# EasyEDA Pro project RM_超级电容控制板.eprj, board PCB_超电功率板
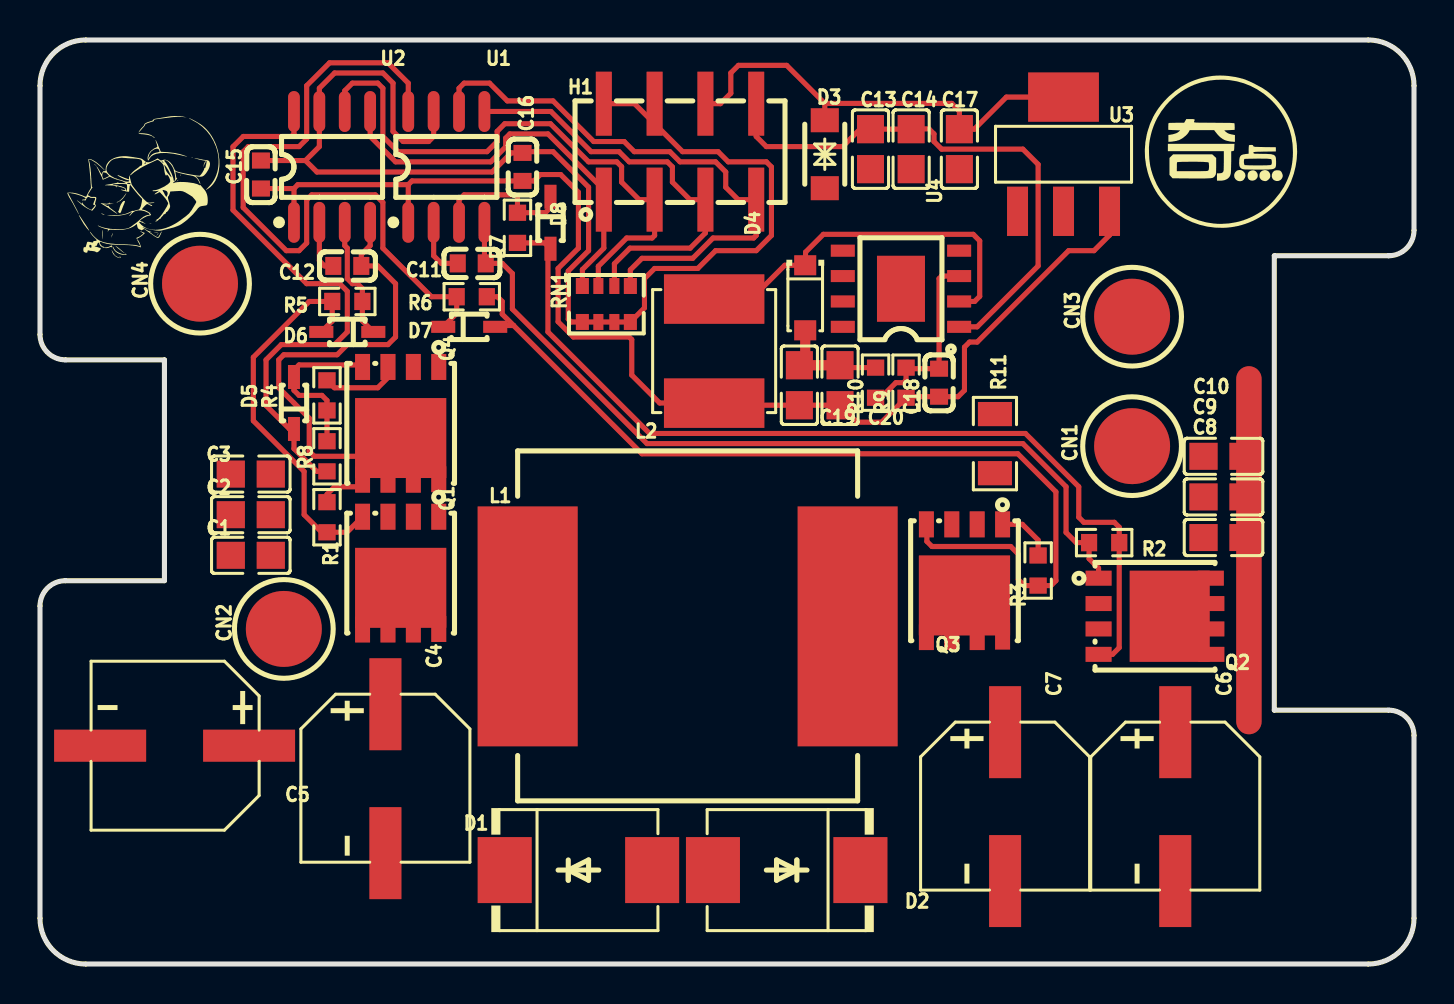
[diagram p5: board, top side]
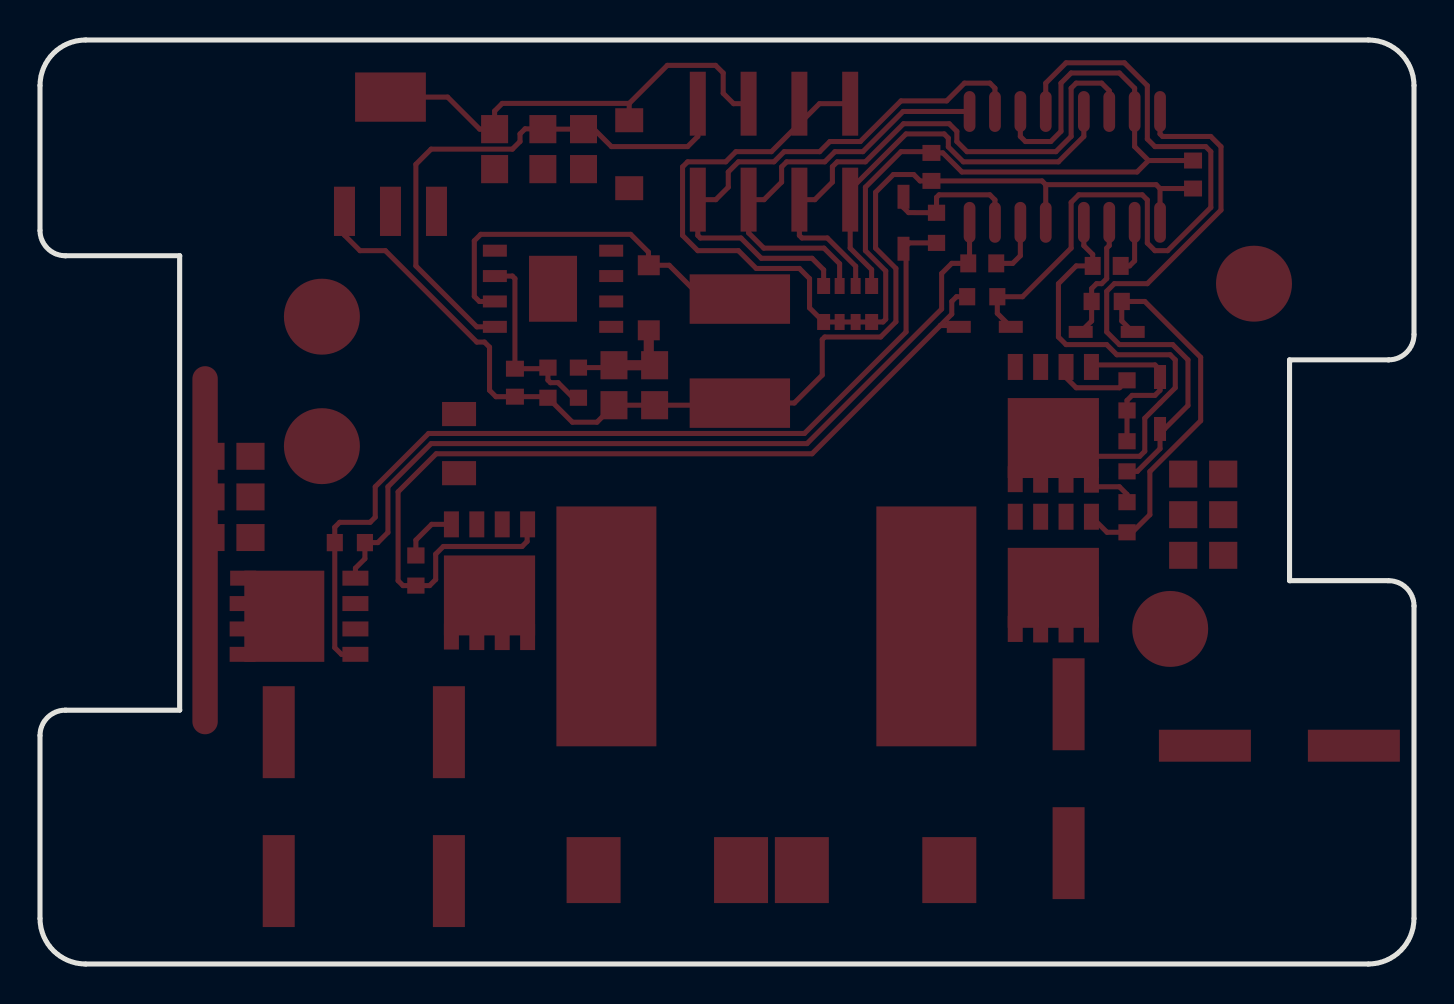
[diagram p6: board, bottom side, seen from below]

Outline 68.71 x 46.23 mm; copper layers: Top Layer, Bottom Layer. Coordinates in mm from the lower left corner of the outline.
Outline path: 0,43.94 arc(0.67,45.56) 2.29,46.23 66.42,46.23 arc(68.04,45.56) 68.71,43.94 68.71,36.7 arc(68.34,35.8) 67.44,35.43 61.72,35.43 61.72,12.7 67.44,12.7 arc(68.34,12.33) 68.71,11.43 68.71,2.29 arc(68.04,0.67) 66.42,0 2.29,0 arc(0.67,0.67) 0,2.29 0,17.91 arc(0.37,18.81) 1.27,19.18 6.22,19.18 6.22,30.23 1.27,30.23 arc(0.37,30.6) 0,31.5 0,43.94
Stack: Top Layer 0.035mm / Dielectric1 1.51mm FR4 er 4.5 / Bottom Layer 0.035mm

## Design rules (mm)
spacing Default (default): track to track 0.152, other pairs 0 to 0.152
track width Default (default): min 0.254, default 0.254, max 25.4
differential pair differentialPair (default): width min 0.127, default 0.254, max 2.54; gap min 0.152, default 0.152
via Default (default): diameter min 0.61, default 0.61, max 100.025; hole min 0.305, default 0.305, max 59.995
net SW1 uses gge220560
net VCC uses gge220506
net SW2 uses gge220569
net VCUP uses gge220584
net GND uses gge220668
pour e2 uses gge178568(1)
pour e379 uses gge220506
pour e380 uses gge220560
pour e381 uses gge220569
pour e382 uses gge220584
pour e383 uses gge220668

## Placement (name value [footprint] x y rotation side)
C1  22uF  [C0805]  10.54 20.45 180 top
C2  22uF  [C0805]  10.54 22.48 180 top
C3  22uF  [C0805]  10.54 24.51 180 top
C4  220uF  [CAP-SMD_BD8.0-L8.3-W8.3-LS9.3-FD]  17.27 9.27 270 top
C5  220uF  [CAP-SMD_BD8.0-L8.3-W8.3-LS9.3-FD]  6.73 10.92 180 top
C6  220uF  [CAP-SMD_BD8.0-L8.3-W8.3-LS9.3-FD]  56.77 7.87 270 top
C7  220uF  [CAP-SMD_BD8.0-L8.3-W8.3-LS9.3-FD]  48.26 7.87 270 top
C8  22uF  [C0805]  59.18 21.34 0 top
C9  22uF  [C0805]  59.18 23.37 0 top
C10  22uF  [C0805]  59.18 25.4 0 top
C11  100n  [C0603]  21.59 35.05 180 top
C12  100nF  [C0603]  15.37 34.92 180 top
C13  22uF  [C0805]  41.53 40.77 270 top
C14  22uF  [C0805]  43.56 40.77 270 top
C15  1uF  [C0603]  11.05 39.5 90 top
C16  1uF  [C0603]  24.13 39.88 90 top
C17  22uF  [C0805]  45.97 40.77 270 top
C18  330pF  [C0603]  44.96 29.08 90 top
C19  22uF  [C0805]  37.97 28.96 90 top
C20  22uF  [C0805]  40 28.96 90 top
CN1  m3铜柱  [SMT铜柱]  54.61 25.91 0 top
CN2  m3铜柱  [SMT铜柱]  12.19 16.76 0 top
CN3  m3铜柱  [SMT铜柱]  54.61 32.39 0 top
CN4  m3铜柱  [SMT铜柱]  8 34.04 0 top
D1  5.0SMDJ30A  [SMC_L6.9-W5.9-LS7.9-RD]  26.92 4.7 0 top
D2  5.0SMDJ30A  [SMC_L6.9-W5.9-LS7.9-RD]  37.34 4.7 180 top
D3  SMFJ5.0CA  [SOD-123FL_L2.8-W1.8-LS3.7-BI]  39.24 40.51 90 top
D4  DSK310_C713648  [SOD-123_L2.7-W1.8-LS3.7-RD]  38.26 33.33 270 top
D5  1N4007WS  [SOD-323_L1.6-W1.3-LS2.6-RD]  12.7 28.07 90 top
D6  1N4007WS  [SOD-323_L1.6-W1.3-LS2.6-RD]  15.37 31.62 180 top
D7  1N4007WS  [SOD-323_L1.6-W1.3-LS2.6-RD]  21.46 31.88 0 top
D8  1N4007WS  [SOD-323_L1.6-W1.3-LS2.6-RD]  25.53 37.08 270 top
H1  MF254VS-12-08P  [HDR-SMD_8P-P2.54_MF254VS-12-08P]  32 40.64 0 top
L1  15uH  [IND-SMD_L17.5-W17.0_YXMAC1770]  32.38 16.89 0 top
L2  330uH  [IND-SMD_L6.0-W6.0_SWPA6045S]  33.71 30.66 90 top
Q1  BSC070N10NS5  [PG-TDSON-8_L5.0-W6.0-P1.27-BL-EP]  18.03 19.56 180 top
Q2  BSC070N10NS5  [PG-TDSON-8_L5.0-W6.0-P1.27-BL-EP]  55.75 17.4 270 top
Q3  BSC070N10NS5  [PG-TDSON-8_L5.0-W6.0-P1.27-BL-EP]  46.23 19.18 180 top
Q4  BSC070N10NS5  [PG-TDSON-8_L5.0-W6.0-P1.27-BL-EP]  18.03 27.05 180 top
R1  10k  [R0603]  14.35 22.35 90 top
R2  10k  [R0603]  53.21 21.08 180 top
R3  10k  [R0603]  49.91 19.69 90 top
R4  10k  [R0603]  14.35 28.45 270 top
R5  4.7  [R0603]  15.37 33.15 180 top
R6  4.7  [R0603]  21.59 33.38 0 top
R7  4.7  [R0603]  23.88 36.83 270 top
R8  4.7  [R0603]  14.35 25.4 90 top
R9  33k  [R0603]  43.31 29.08 90 top
R10  4.7k  [R0603]  41.78 29.08 90 top
R11  0  [R1206]  47.75 26.03 90 top
RN1  10k  [RES-ARRAY-SMD_0603-8P-L3.2-W1.6-BL]  28.32 33.02 180 top
U1  UCC27211D  [SOIC-8_L4.9-W3.9-P1.27-LS6.2-BL]  20.32 39.88 0 top
U2  UCC27211D  [SOIC-8_L4.9-W3.9-P1.27-LS6.2-BL]  14.6 39.88 0 top
U3  AMS1117-5.0  [SOT-223_L6.5-W3.5-P2.30-LS7.0-BR]  51.18 40.51 270 top
U4  XL7005ADJ  [ESOP-8_L4.9-W3.9-P1.27-LS6.0-BL-EP]  43.05 33.78 90 top

## Footprints (pads in the part's own frame, mm; a bottom-side part is the same pattern mirrored in y, then rotated)
C0603
  rect 0.8x0.9 smd: 1(-0.7,0) 2(0.7,0)
C0805
  rect 1.41x1.35 smd: 1(-1,0) 2(1,0)
CAP-SMD_BD8.0-L8.3-W8.3-LS9.3-FD
  rect 4.6x1.6 smd: 1(-3.724,0) 2(3.724,0)
ESOP-8_L4.9-W3.9-P1.27-LS6.0-BL-EP
  rect 0.6x1.2 smd: 1(-1.905,-2.909) 2(-0.635,-2.909) 3(0.635,-2.909) 4(1.905,-2.909) 5(1.905,2.909) 6(0.635,2.909) 7(-0.635,2.909) 8(-1.905,2.909)
  rect 3.3x2.4 smd: 9(0,0)
HDR-SMD_8P-P2.54_MF254VS-12-08P
  rect 0.8x3.2 smd: 1(-3.81,-2.4) 2(-3.81,2.4) 3(-1.27,-2.4) 4(-1.27,2.4) 5(1.27,-2.4) 6(1.27,2.4) 7(3.81,-2.4) 8(3.81,2.4)
IND-SMD_L6.0-W6.0_SWPA6045S
  rect 2.474x5.02 smd: 1(-2.603,0) 2(2.603,0)
IND-SMD_L17.5-W17.0_YXMAC1770
  rect 5x12 smd: 1(-8,0) 2(8,0)
PG-TDSON-8_L5.0-W6.0-P1.27-BL-EP
  rect 0.75x1.3 smd: 1(-1.905,-2.82) 2(-0.635,-2.82) 3(0.635,-2.82) 4(1.905,-2.82) 5(1.905,2.82) 6(0.635,2.82) 7(-0.635,2.82) 8(-1.905,2.794)
  rect 4.56x4 smd: 9(0,0.737)
R0603
  rect 0.806x0.864 smd: 1(-0.753,0) 2(0.753,0)
R1206
  rect 1.208x1.701 smd: 1(-1.479,0) 2(1.479,0)
RES-ARRAY-SMD_0603-8P-L3.2-W1.6-BL
  rect 0.65x0.8 smd: 1(-1.2,-0.9) 4(1.2,-0.9) 5(1.2,0.9) 8(-1.2,0.9)
  rect 0.5x0.8 smd: 2(-0.4,-0.9) 3(0.4,-0.9) 6(0.4,0.9) 7(-0.4,0.9)
SMC_L6.9-W5.9-LS7.9-RD
  rect 2.7x3.3 smd: 1(-3.687,0) 2(3.687,0)
SMT铜柱
  round 3.8 smd: 1(0.001,0)
SOD-123_L2.7-W1.8-LS3.7-RD
  rect 1x1.1 smd: 1(-1.627,0) 2(1.627,0)
SOD-123FL_L2.8-W1.8-LS3.7-BI
  rect 1.2x1.4 smd: 1(-1.7,0) 2(1.7,0)
SOD-323_L1.6-W1.3-LS2.6-RD
  rect 1.2x0.6 smd: 1(-1.3,0) 2(1.3,0)
SOIC-8_L4.9-W3.9-P1.27-LS6.2-BL
  oval 0.588x2.045 smd: 1(-1.905,-2.772) 2(-0.635,-2.772) 3(0.635,-2.772) 4(1.905,-2.772) 5(1.905,2.772) 6(0.635,2.772) 7(-0.635,2.772) 8(-1.905,2.772)
SOT-223_L6.5-W3.5-P2.30-LS7.0-BR
  rect 2.465x1.05 smd: 1(2.857,-2.3) 2(2.857,0) 3(2.857,2.3)
  rect 2.465x3.54 smd: 4(-2.857,0)

## Nets
As in the schematic.

Pads without a net: Q1 9; Q2 9; Q3 9; Q4 9; U3 2; U4 4

## Routing (per net, layer and track width the routed paths; a pad name or vN(x,y) marks a point on that pad's centre or on a via; arc(x,y) is an arc through that point)
10V: length 64.5
  Top Layer w0.254: 53.1,37.48 53.28,37.66 53.48,37.66 53.48,36.46 52.71,35.69 51.44,35.69 46.86,31.11 46.48,31.11 46.23,30.86 46.23,28.7 45.91,28.38 44.96,28.38 ; U2.1 12.7,38.8 ; 12.7,38.8 C15.1 ; 12.7,38.8 12.89,38.99 18.41,38.99 ; 18.41,37.11 18.41,38.99 ; 18.41,38.99 18.6,39.18 24.7,39.18 25.02,39.5 26.03,39.5 26.92,38.61 26.92,35.81 25.91,34.8 25.91,32.13 26.67,31.37 29.46,31.37 29.59,31.24 29.59,29.46 30.99,28.07 33.71,28.07 ; C18.1 43.36,28.38 R9.1 42.08,27.11 40.85,27.11 C20.1 C19.1 33.81,27.96 L2.1
+5V: length 22.7
  Top Layer w0.254: H1.6 34.02,43.04 34.54,43.56 34.54,44.58 34.93,44.96 37.34,44.96 39.24,43.05 39.24,42.21 ; U3.4 48.32,43.37 46.72,41.77 C17.1 45.97,42.67 45.59,43.06 39.24,43.06
GND: length 94.6
  Top Layer w0.254: 27.12,32.12 26.55,32.12 26.42,32.26 26.42,34.67 27.43,35.69 27.43,38.86 25.65,40.64 24.19,40.64 24.13,40.58 23.56,40.58 22.61,39.62 13.85,39.62 13.27,40.2 ; 19.69,42.65 19.69,41.4 19.43,41.15 18.16,41.15 17.65,41.66 17.65,44.07 17.14,44.58 14.73,44.58 13.97,43.81 13.97,40.89 13.27,40.2 C15.2 ; 48.13,22 49.12,22 49.91,21.21 49.91,20.44 ; Q4.3 17.4,29.34 16.89,28.83 14.72,28.83 R4.1 ; C20.2 40.12,29.84 R10.2 ; RN1.5 RN1.6 RN1.7 RN1.8 30.23,32.82 30.23,34.29 30.73,34.8 32.89,34.8 33.78,35.69 35.81,35.69 36.58,36.45 36.58,39.88 36.32,40.13 34.42,40.13 33.91,40.64 32.13,40.64 29.73,43.04 H1.2
  Top Layer w0.508: C20.2 C19.2 38.27,30.25 38.27,31.7
  Top Layer w1.27: 60.45,29.27 60.45,12.13
VCC1: length 27.6
  Top Layer w0.254: 45.96,31.88 46.86,31.88 49.91,34.92 49.91,40 49.15,40.77 45.09,40.77 44.7,41.15 44.7,41.53 44.45,41.78 C14.1 C13.1 41,41.77 40.13,40.89 36.32,40.89 35.81,41.4 H1.8
HRTIM1_CHA1: length 28.9
  Top Layer w0.254: 20.96,42.65 20.96,43.81 21.21,44.07 22.48,44.07 23.37,43.18 25.65,43.18 27.69,41.15 29.21,41.15 29.72,40.64 31.5,40.64 32,40.13 33.78,40.13 34.29,39.62 34.29,38.86 34.91,38.24 H1.7 ; H1.7 35.81,36.45 35.69,36.32 33.66,36.32 32.64,35.31 30.1,35.31 29.52,34.73 RN1.1 ; H1.7 35.67,38.24 H1.7
HRTIM1_CHA2: length 21.5
  Top Layer w0.254: 28.72,33.92 28.72,35.03 29.5,35.81 32.51,35.81 33.27,36.58 H1.5 ; H1.5 32.5,38.24 31.62,39.12 31.62,39.88 31.37,40.13 29.46,40.13 28.96,40.64 27.56,40.64 25.55,42.65 22.22,42.65 ; H1.5 33.27,38.48
HRTIM1_CHB1: length 28.7
  Top Layer w0.254: RN1.3 27.92,34.91 29.34,36.32 30.61,36.32 30.73,36.45 H1.3 29.96,38.24 29.08,39.12 29.08,39.89 28.84,40.13 27.43,40.13 25.53,42.04 23.24,42.04 22.86,41.66 22.86,41.15 22.35,40.64 17.91,40.64 17.14,41.4 17.14,43.81 16.89,44.07 15.62,44.07 15.24,43.69 15.24,42.65
HRTIM1_CHB2: length 21.1
  Top Layer w0.254: 16.51,42.65 16.51,41.4 17.78,40.13 22.54,40.13 23.29,40.88 23.29,41.32 23.5,41.53 25.4,41.53 28.19,38.73 H1.1 ; 28.19,38.62 H1.1 ; H1.1 28.19,35.81 27.12,34.74 27.12,33.92
SW1: length 42.5
  Top Layer w0.254: 22.22,37.11 22.22,35.12 C11.1 22.29,35.07 22.22,35.13 ; 22.29,35.05 23.11,35.05 23.62,34.54 23.62,32.77 30.35,26.03 49.15,26.03 51.31,23.88 51.31,21.59 51.82,21.08 52.46,21.08 ; Q2.1 52.93,19.8 52.46,20.28 R2.2
SW2: length 26.4
  Top Layer w0.254: R1.2 14.35,23.5 14.73,23.88 16.13,23.88 16.13,24.23 ; 16.51,37.11 16.51,35.94 16.07,35.5 C12.1 16.89,34.92 17.78,34.04 17.78,31.37 17.4,30.99 15.37,30.99 14.86,30.48 12.19,30.48 11.94,30.23 11.94,28.83 13.46,27.31 13.46,25.65 13.72,25.4 17.12,25.4 18.03,26.31
$1N34: length 8.5
  Top Layer w0.254: R8.2 R4.2 14.35,28.19 14.1,28.45 12.95,28.45 12.7,28.7 12.7,29.72 12.95,29.97 16.03,29.97 16.13,29.87
$1N35: length 19.4
  Top Layer w0.254: D6.2 14.61,32.17 R5.2 ; 14.61,33.15 13.46,33.15 10.67,30.35 10.67,27.18 13.21,24.64 13.21,22.48 14.09,21.6 R1.1 15.35,21.6 16.13,22.38
$1N36: length 46.7
  Top Layer w0.254: R2.1 53.97,15.83 53.63,15.49 52.93,15.49 ; R7.2 25.23,36.08 D8.2 25.4,35.66 25.4,31.62 30.48,26.54 49.28,26.54 51.94,23.88 51.94,22.35 52.2,22.1 53.72,22.1 53.97,21.85 53.97,21.08
$1N40: length 47.3
  Top Layer w0.254: 49.91,18.93 49.22,18.93 48.92,19.24 48.92,20.51 48.54,20.89 44.6,20.89 44.35,21.14 44.35,21.97 Q3.4 ; D7.2 22.83,31.94 23.68,31.94 ; 23.68,31.94 30.1,25.53 48.9,25.53 50.8,23.62 50.8,19.18 50.55,18.93 49.91,18.93 ; 23.68,31.94 23.11,32.51 23.11,33.15 22.88,33.38 R6.2
$1N92: length 3
  Top Layer w0.254: C11.2 20.07,35.05 19.69,35.43 U1.2
$1N105: length 29
  Top Layer w0.254: R8.1 13.84,24.65 12.7,25.78 12.7,26.77 12.48,26.77 11.3,27.94 11.3,30.23 12.06,30.99 14.73,30.99 15.37,31.62 15.37,33.66 14.99,34.04 13.33,34.04 9.65,37.72 9.65,40.89 10.17,41.4 12.57,41.4 12.7,41.53 12.7,42.65
$1N120: length 6.2
  Top Layer w0.254: D6.1 16.12,32.17 R5.1 16.12,33.79 15.88,34.04 15.62,34.04 15.37,34.29 15.37,35.81 15.24,35.94 U2.3
$1N161: length 7.3
  Top Layer w0.254: D8.1 25.53,37.85 25.27,37.59 R7.1 23.88,38.35 23.75,38.48 21.21,38.48 20.96,38.23 20.96,37.11
$1N172: length 35.5
  Top Layer w0.254: 20.16,31.88 20.84,32.55 R6.1 19.58,33.38 17.14,35.81 17.14,38.1 16.76,38.48 13.59,38.48 13.33,38.23 13.33,36.07 12.95,35.69 12.32,35.69 10.16,37.85 10.16,40.64 10.41,40.89 12.95,40.89 13.33,41.28 13.33,43.94 14.48,45.08 17.4,45.08 18.41,44.07 U1.8
$1N280: length 10
  Top Layer w0.254: C18.2 43.36,29.78 R9.2 43.31,29.21 43.18,29.08 42.8,29.08 42.04,28.32 41.78,28.32 ; C18.2 44.96,29.66 44.83,29.66 ; C18.2 44.96,34.29 45.09,34.42 45.96,34.42
$1N391: length 19
  Top Layer w0.254: 38.27,34.96 37.24,34.96 35.55,33.27 L2.2 ; 38.26,34.96 38.28,35.62 39.17,36.5 46.66,36.5 46.99,36.18 46.99,33.4 46.74,33.15 45.96,33.15
$1N753: length 2.7
  Top Layer w0.254: 13.97,37.11 13.97,35.18 14.22,34.92 C12.2

## Copper pours and planes (outline as drawn; the poured copper is in the pictures)
GND on Top Layer: -4.57,54.61 70.23,54.61 71.75,53.09 71.75,-4.57 71.63,-4.7 -4.7,-4.7
VCC on Top Layer: 51.44,28.83 58.42,28.83 58.93,28.32 58.93,20.45 59.18,20.19 59.18,10.92 57.53,9.27 45.72,9.27 42.42,6.35 42.42,3.05 39.62,3.05 39.62,7.37 47.24,14.86 53.59,14.73 54.36,15.49 54.36,22.1 50.93,25.53 50.93,28.19
VCC on Bottom Layer: 54.46,15.11 54.46,19.69 58.52,19.69 58.52,15.11
SW1 on Top Layer: 37.85,22.86 42.93,22.86 43.43,22.35 43.43,21.46 44.32,20.57 48.64,20.57 49.02,20.19 53.21,20.19 53.59,19.81 53.59,16.26 53.09,15.75 47.75,15.75 42.93,10.92 37.97,10.92
SW1 on Bottom Layer: 43.94,20.45 48.51,20.45 48.51,16.38 43.94,16.38
SW2 on Top Layer: 15.75,28.32 20.32,28.32 25.78,22.86 26.8,22.86 26.8,10.92 21.97,10.92 21.84,19.81 20.19,21.46 17.14,21.46 16.76,21.84 16.76,22.73 15.75,23.75
VCUP on Top Layer: 10.8,25.4 12.19,25.4 12.83,24.64 12.83,21.08 13.08,20.83 20.32,20.83 20.32,12.7 24.64,8.25 24.64,3.05 21.84,3.05 21.84,6.35 18.16,10.03 8.13,10.03 8.13,17.02 10.8,19.69
